# Altium schematic sheet PowerSupply.SchDoc
size A4
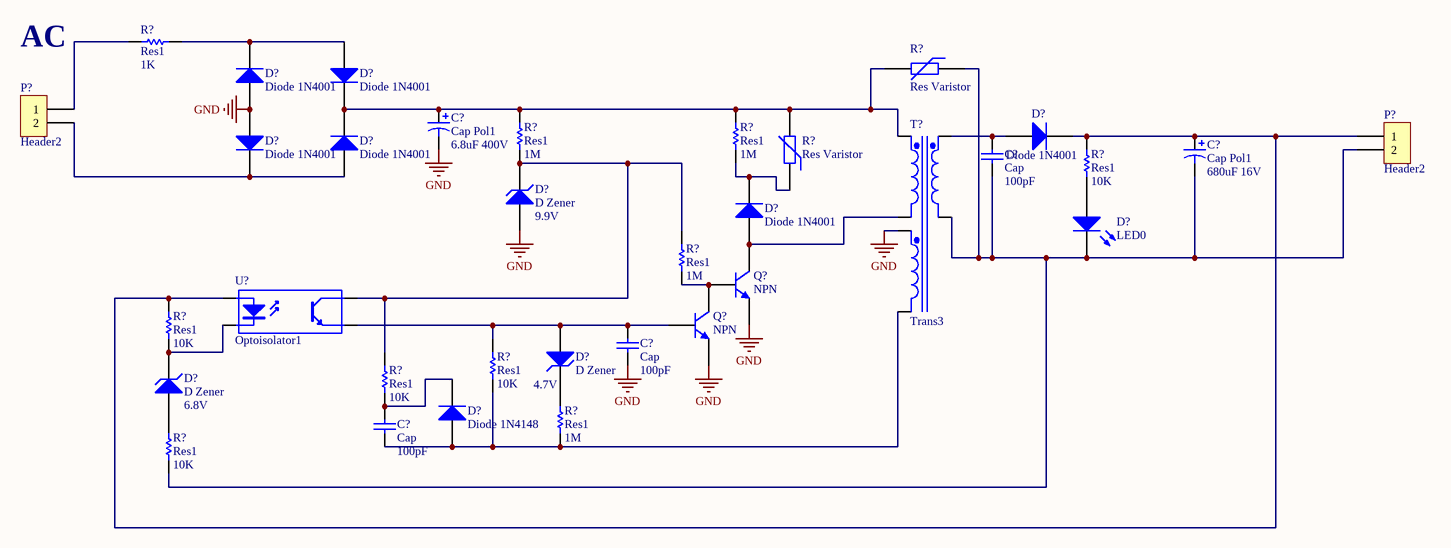
[diagram p0: PowerSupply.SchDoc]

## Parts
(Parts that share a designator on the sheet are numbered #1, #2 ... from top to bottom, then left to right.)
C?#1  Cap Pol1  value 6.8uF 400V  [CAPPR2-5x6.8]
C?#2  Cap Pol1  value 680uF 16V  [CAPPR2-5x6.8]
C?#3  Cap  value 100pF  [CAPR2.54-5.1x3.2]
C?#4  Cap  value 100pF  [CAPR2.54-5.1x3.2]
C?#5  Cap  value 100pF  [CAPR2.54-5.1x3.2]
D?#1  Diode 1N4001  [DIO10.46-5.3x2.8]
D?#2  Diode 1N4001  [DIO10.46-5.3x2.8]
D?#3  Diode 1N4001  [DIO10.46-5.3x2.8]
D?#4  Diode 1N4001  [DIO10.46-5.3x2.8]
D?#5  Diode 1N4001  [DIO10.46-5.3x2.8]
D?#6  D Zener  value 9.9V  [DIODE-0.7]
D?#7  Diode 1N4001  [DIO10.46-5.3x2.8]
D?#8  LED0  [LED-0]
D?#9  D Zener  value 4.7V  [DIODE-0.7]
D?#10  D Zener  value 6.8V  [DIODE-0.7]
D?#11  Diode 1N4148  [DIO7.1-3.9x1.9]
P?#1  Header2  [Header2Macho]
P?#2  Header2  [Header2Macho]
Q?#1  NPN  [BCY-W3]
Q?#2  NPN  [BCY-W3]
R?#1  Res1  value 1K  [AXIAL-0.3]
R?#2  Res Varistor  [RESC2012N]
R?#3  Res1  value 1M  [AXIAL-0.3]
R?#4  Res1  value 1M  [AXIAL-0.3]
R?#5  Res Varistor  [RESC2012N]
R?#6  Res1  value 10K  [AXIAL-0.3]
R?#7  Res1  value 1M  [AXIAL-0.3]
R?#8  Res1  value 10K  [AXIAL-0.3]
R?#9  Res1  value 10K  [AXIAL-0.3]
R?#10  Res1  value 10K  [AXIAL-0.3]
R?#11  Res1  value 10K  [AXIAL-0.3]
R?#12  Res1  value 1M  [AXIAL-0.3]
T?  Trans3  [TRF_6]
U?  Optoisolator1  [DIP-4]

## Nets
GND: C?#1.2 C?#4.1 D?#2.1(A) D?#4.1(A) D?#6.1(A) Q?#1.3(E) Q?#2.3(E) T?.5(Sec2+)
NetC?#1_1: C?#1.1 D?#1.2(K) D?#5.2(K) R?#2.2 R?#3.1 R?#4.1 R?#5.2 T?.3(Sec1+)
NetC?#2_1: C?#2.1 D?#3.2(K) P?#2.1 R?#6.2 R?#8.2 U?.1(A)
NetC?#2_2: C?#2.2 C?#3.1 D?#8.2(K) P?#2.2 R?#2.1 R?#11.2 T?.2(Pri-)
NetC?#3_2: C?#3.2 D?#3.1(A) T?.1(Pri+)
NetC?#4_2: C?#4.2 D?#9.1(A) Q?#2.2(B) R?#9.2 U?.3(E)
NetC?#5_1: C?#5.1 D?#11.1(A) R?#9.1 R?#12.1 T?.6(Sec2-)
NetC?#5_2: C?#5.2 D?#11.2(K) R?#10.1
NetD?#1_1: D?#1.1(A) D?#2.2(K) R?#1.2
NetD?#4_2: D?#4.2(K) D?#5.1(A) P?#1.2
NetD?#6_2: D?#6.2(K) R?#3.2 R?#7.2 R?#10.2 U?.4(C)
NetD?#7_1: D?#7.1(A) Q?#1.1(C) T?.4(Sec1-)
NetD?#7_2: D?#7.2(K) R?#4.2 R?#5.1
NetD?#8_1: D?#8.1(A) R?#6.1
NetD?#9_2: D?#9.2(K) R?#12.2
NetD?#10_1: D?#10.1(A) R?#11.1
NetD?#10_2: D?#10.2(K) R?#8.1 U?.2(K)
NetP?#1_1: P?#1.1 R?#1.1
NetQ?#1_2: Q?#1.2(B) Q?#2.1(C) R?#7.1

## Notes on the sheet
- AC

## Library data of the parts
C?#1 C?#2 = Cap Pol1: Polarized Capacitor (Radial); Published: 8-Jun-2000; LatestRevisionDate: 17-Jul-2002; LatestRevisionNote: Re-released for DXP Platform.; PackageReference: RB7.6-15; Publisher: Altium Limited
C?#3-C?#5 = Cap: Capacitor; Published: 8-Jun-2000; LatestRevisionDate: 17-Jul-2002; LatestRevisionNote: Re-released for DXP Platform.; PackageReference: RAD-0.3; Publisher: Altium Limited
D?#1-D?#5 D?#7 = Diode 1N4001: 1 Amp General Purpose Rectifier; Published: 8-Jun-2000; LatestRevisionDate: 17-Jul-2002; LatestRevisionNote: Re-released for DXP Platform.; DatasheetVersion: 1998; PackageVersion: Aug-1999; PackageReference: DO-41; Publisher: Altium Limited; Code_JEDEC: DO-204-AL; ComponentLink1Description: Manufacturer Link; ComponentLink1URL: http://www.fairchildsemi.com/; ComponentLink2Description: Datasheet; ComponentLink2URL: http://www.fairchildsemi.com/ds/1N%2F1N4001.pdf
D?#6 D?#9 D?#10 = D Zener: Zener Diode; Published: 8-Jun-2000; LatestRevisionDate: 17-Jul-2002; LatestRevisionNote: Re-released for DXP Platform.; PackageReference: DIODE-0.7; Publisher: Altium Limited
D?#8 = LED0: Typical INFRARED GaAs LED; Published: 8-Jun-2000; LatestRevisionDate: 08-Jul-2005; LatestRevisionNote: Mech Layer 1 removed.; PackageReference: LED-0; Publisher: Altium Limited
D?#11 = Diode 1N4148: High Conductance Fast Diode; Published: 8-Jun-2000; LatestRevisionDate: 17-Jul-2002; LatestRevisionNote: Re-released for DXP Platform.; DatasheetVersion: 1997; PackageReference: DO-35; Publisher: Altium Limited; Code_JEDEC: DO-204-AH; ComponentLink1Description: Manufacturer Link; ComponentLink1URL: http://www.fairchildsemi.com/; ComponentLink2Description: Datasheet; ComponentLink2URL: http://www.fairchildsemi.com/ds/1N%2F1N4148.pdf
Q?#1 Q?#2 = NPN: NPN Bipolar Transistor; Published: 8-Jun-2000; LatestRevisionDate: 17-Jul-2002; LatestRevisionNote: Re-released for DXP Platform.; PackageReference: TO-226; Publisher: Altium Limited; Code_JEDEC: TO-226-AA
R?#1 R?#3 R?#4 R?#6-R?#12 = Res1: Resistor; Published: 8-Jun-2000; LatestRevisionDate: 17-Jul-2002; LatestRevisionNote: Re-released for DXP Platform.; PackageReference: AXIAL-0.3; Publisher: Altium Limited
R?#2 R?#5 = Res Varistor: Varistor (Voltage-Sensitive Resistor); Published: 24-Mar-1999; LatestRevisionDate: 29-May-2009; LatestRevisionNote: IPC-7351 Footprint Added.; PackageVersion: Mar-2003; PackageReference: 6-0805; Publisher: Altium Limited; PackageDescription: Chip Resistor 0805 Case Size; Code_IPC: RESC2012
T? = Trans3: Three-winding Transformer (Non-Ideal); Sim Note: Enter the turns ratios, Core loss resistance, Magnetising Reactance, Leakage Reactances and Resistances referred to the primary side into the parameter fields.; Published: 25-Jan-2001; LatestRevisionDate: 17-Jul-2002; LatestRevisionNote: Re-released for DXP Platform.; PackageReference: TRF_6; Publisher: Altium Limited
U? = Optoisolator1: 4-Pin Phototransistor Optocoupler; Published: 24-Mar-1999; LatestRevisionDate: 04-Mar-2005; LatestRevisionNote: Sch pins 3 & 4 Swapped.; DatasheetVersion: Nov-2003; PackageReference: DIP-4; Publisher: Altium Limited